# EAGLE design klavesnice (EAGLE 5.06)

## Sheet 1 of 3
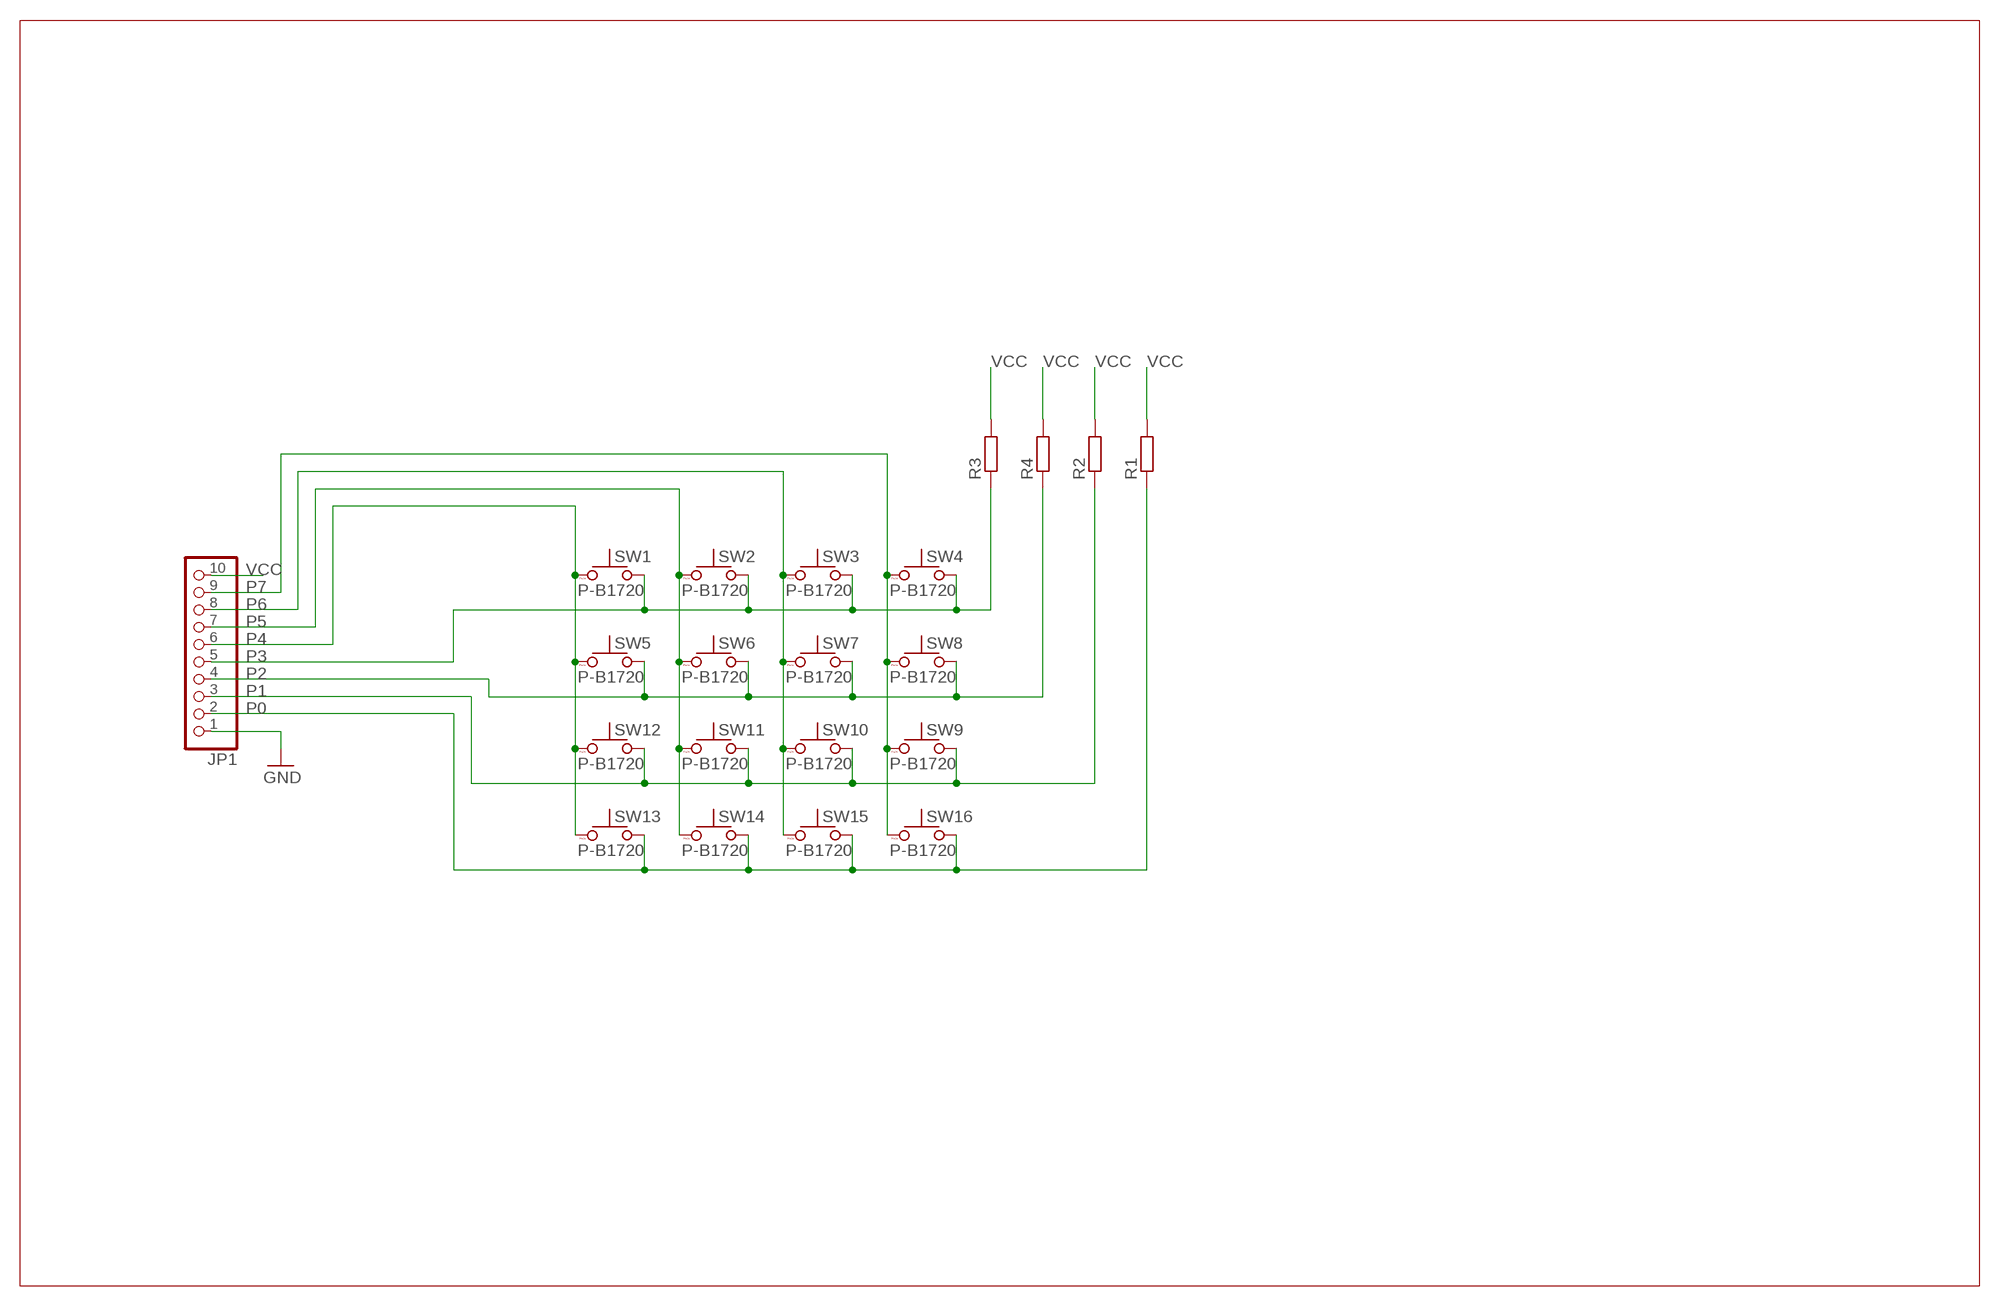
[diagram p0: schematic, sheet 1]

### Parts
JP1  PINHD-1X10_2.54-90°  [1X10/90]
R1  R-EU_M1206  [M1206]
R2  R-EU_M1206  [M1206]
R3  R-EU_M1206  [M1206]
R4  R-EU_M1206  [M1206]
SW1  P-B1720  [P-B1720]
SW2  P-B1720  [P-B1720]
SW3  P-B1720  [P-B1720]
SW4  P-B1720  [P-B1720]
SW5  P-B1720  [P-B1720]
SW6  P-B1720  [P-B1720]
SW7  P-B1720  [P-B1720]
SW8  P-B1720  [P-B1720]
SW9  P-B1720  [P-B1720]
SW10  P-B1720  [P-B1720]
SW11  P-B1720  [P-B1720]
SW12  P-B1720  [P-B1720]
SW13  P-B1720  [P-B1720]
SW14  P-B1720  [P-B1720]
SW15  P-B1720  [P-B1720]
SW16  P-B1720  [P-B1720]

### Nets
GND: JP1.1
P0: JP1.2 R1.1 SW13.2 SW14.2 SW15.2 SW16.2
P1: JP1.3 R2.1 SW9.2 SW10.2 SW11.2 SW12.2
P2: JP1.4 R4.1 SW5.2 SW6.2 SW7.2 SW8.2
P3: JP1.5 R3.1 SW1.2 SW2.2 SW3.2 SW4.2
P4: JP1.6 SW1.1 SW5.1 SW12.1 SW13.1
P5: JP1.7 SW2.1 SW6.1 SW11.1 SW14.1
P6: JP1.8 SW3.1 SW7.1 SW10.1 SW15.1
P7: JP1.9 SW4.1 SW8.1 SW9.1 SW16.1
VCC: JP1.10 R1.2 R2.2 R3.2 R4.2
Unconnected: SW1.3 SW1.4 SW2.3 SW2.4 SW3.3 SW3.4 SW4.3 SW4.4 SW5.3 SW5.4 SW6.3 SW6.4 SW7.3 SW7.4 SW8.3 SW8.4 SW9.3 SW9.4 SW10.3 SW10.4 SW11.3 SW11.4 SW12.3 SW12.4 SW13.3 SW13.4 SW14.3 SW14.4 SW15.3 SW15.4 SW16.3 SW16.4

## Sheet 2 of 3
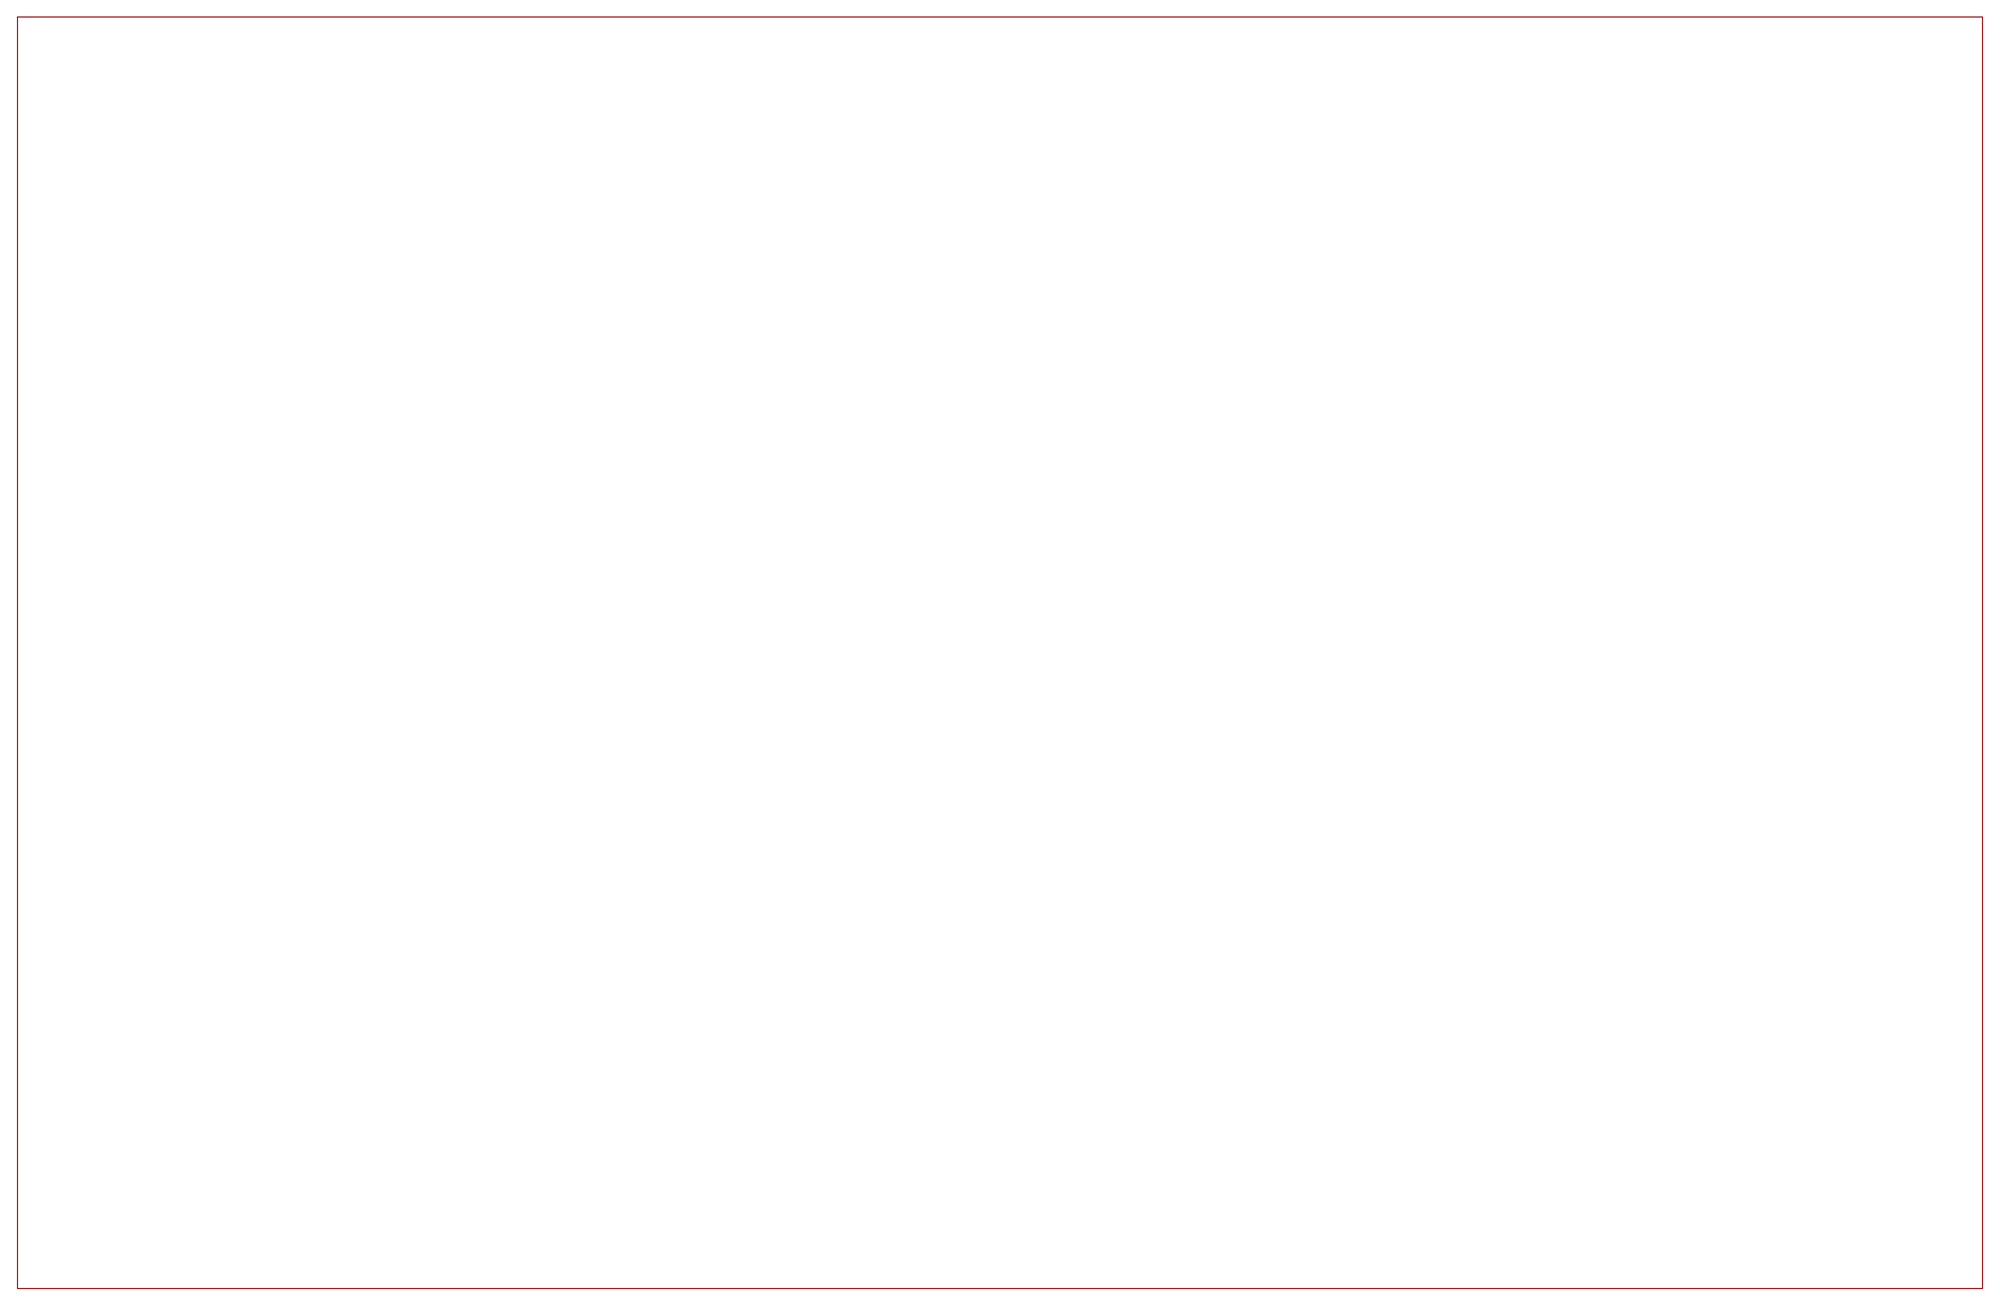
[diagram p1: schematic, sheet 2]

## Sheet 3 of 3
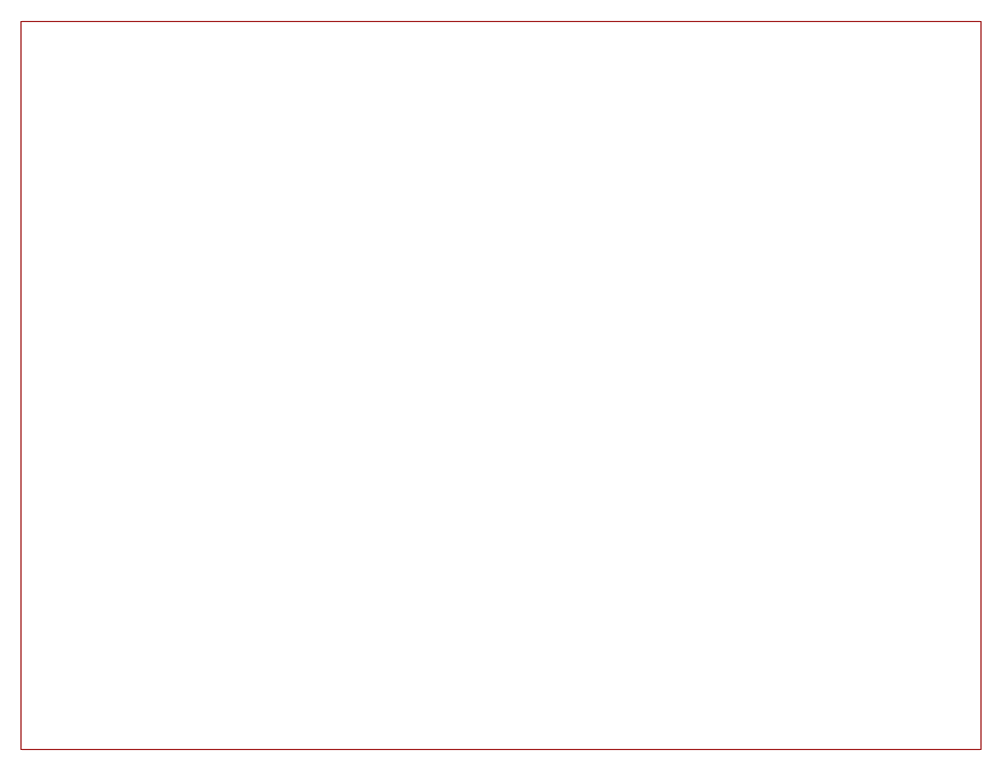
[diagram p2: schematic, sheet 3]

## Library data of the parts
JP1 = acon-tyco (19):PINHD-1X10: PIN HEADER
R1-R4 = resistor:R-EU_: RESISTOR, European symbol
SW1-SW16 = #PaJa_prepinace:P-B1720: µ-tlacitko

## Board
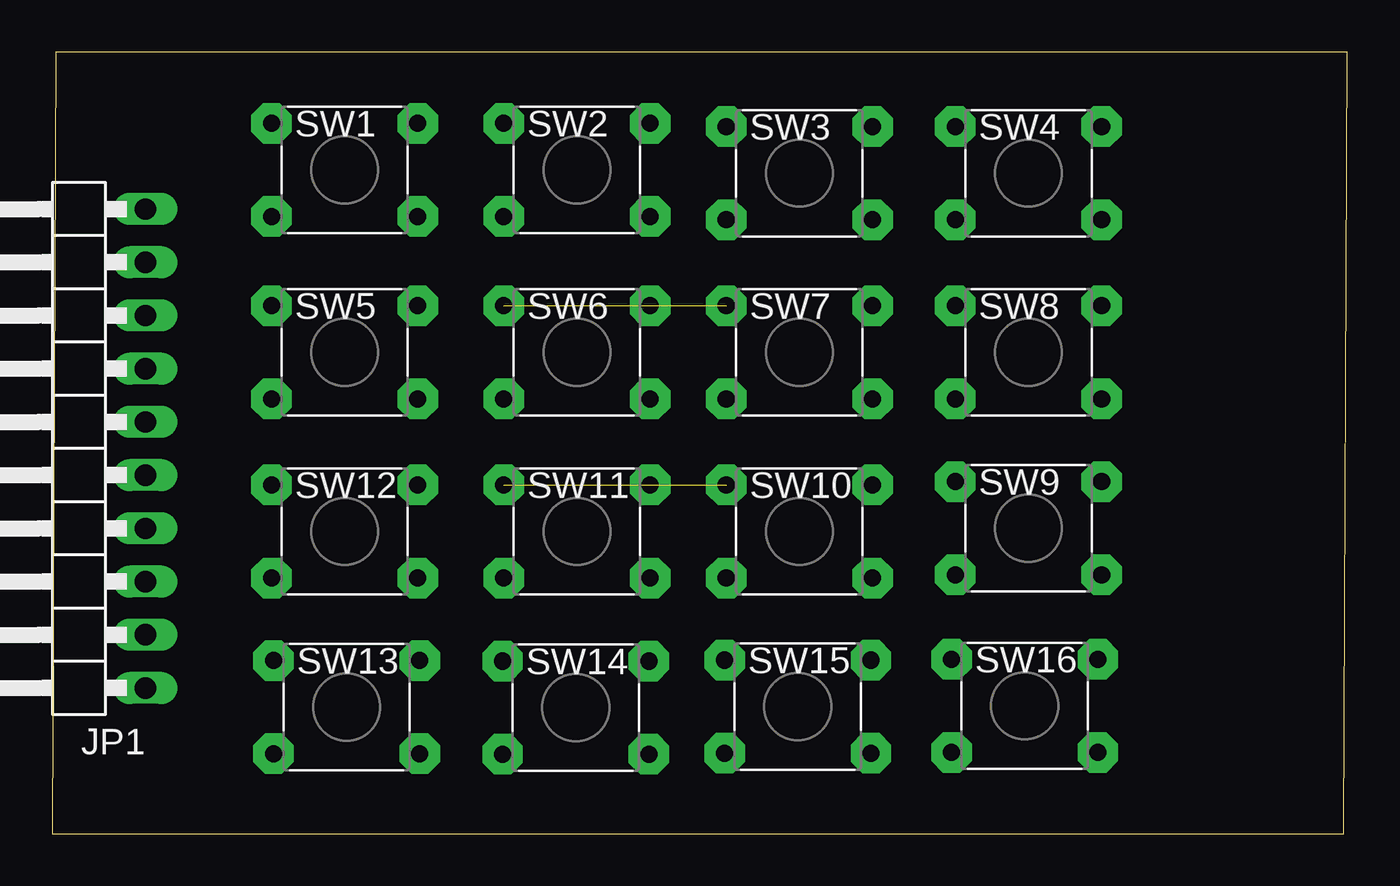
[diagram p3: board, top side]
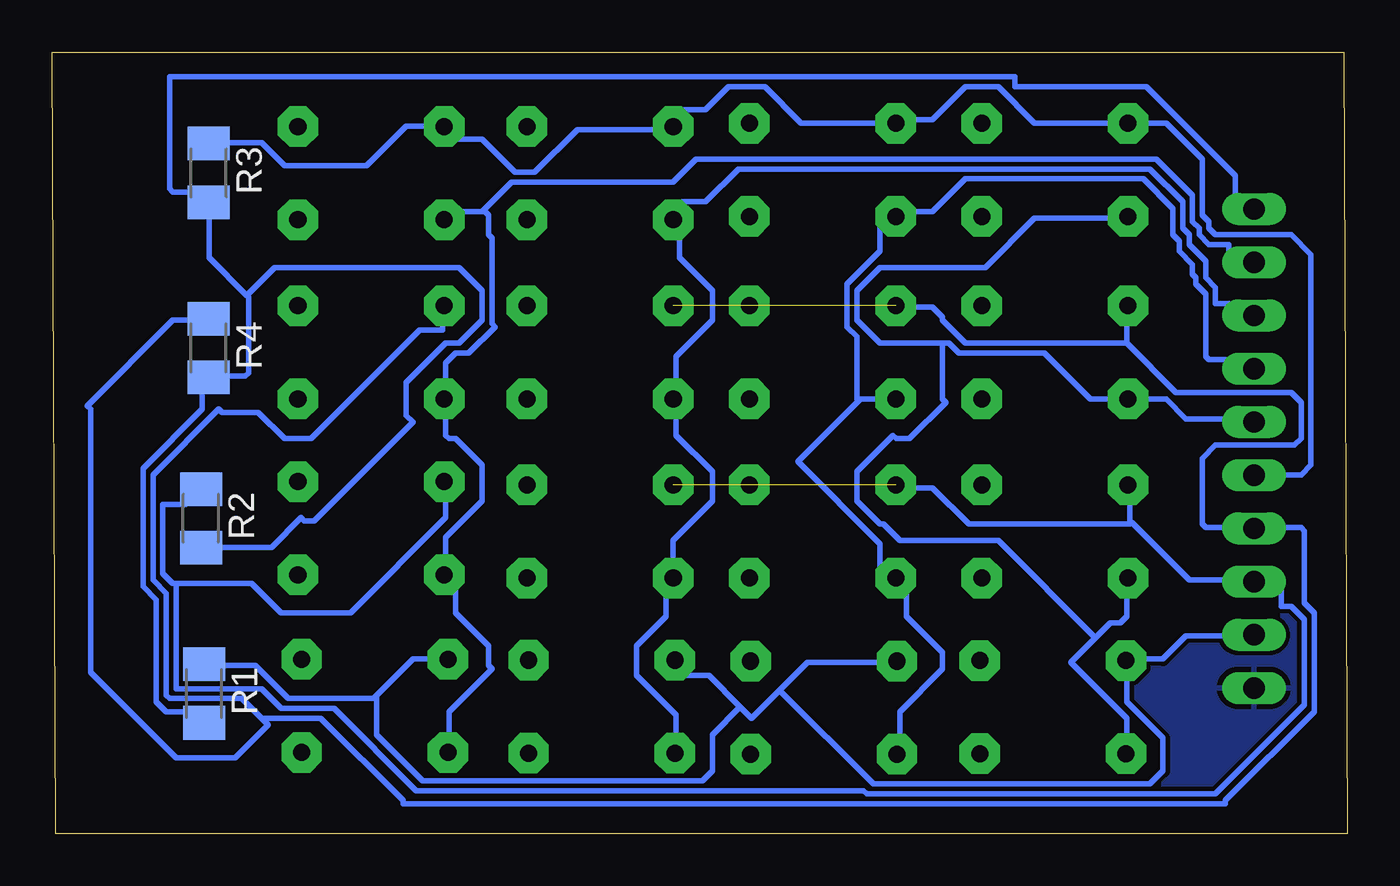
[diagram p4: board, bottom side, seen from below]

Size 61.8 x 37.29 mm. Coordinates in mm from the lower left corner, seen from the top.
Outline: 0,0 61.64,0 61.8,37.29 0.16,37.29 0,0
Copper layers (1*16): Top 0.035mm / dielectric 1.5mm / Bottom 0.035mm
Design rules "default": minimum track width 10mil, minimum drill 24mil, track to track 8mil, track to pad 8mil, pad to pad 8mil, via to via 8mil, smd to smd 8mil, copper to edge 40mil, drill to drill 8mil, minimum pad ring 10mil, minimum via ring 8mil, stop-mask expansion 4mil, vias tented up to drill 0mil, thermal gap 10mil

### Footprints (pad centres in the part's own frame; a part is rotated, then mirrored left to right if it is on the bottom)
1X10/90 = drill 1.016 long: 1 -11.43,-3.81; 2 -8.89,-3.81; 3 -6.35,-3.81; 4 -3.81,-3.81; 5 -1.27,-3.81; 6 1.27,-3.81; 7 3.81,-3.81; 8 6.35,-3.81; 9 8.89,-3.81; 10 11.43,-3.81
M1206 = smd 1.6 x 2: 1 -1.4,0; 2 1.4,0
P-B1720 = drill 0.813 pad 1.93 octagon: 1 -3.493,-2.223; 2 -3.493,2.223; 3 3.493,-2.223; 4 3.493,2.223

### Placement (x,y rotation side)
JP1  0.63,18.38 90 top
R1  54.55,6.69 270 bottom
R2  54.7,15.05 270 bottom
R3  54.34,31.54 270 bottom
R4  54.34,23.18 270 bottom
SW1  13.95,31.68 0 top
SW2  25.04,31.68 0 top
SW3  35.66,31.53 0 top
SW4  46.58,31.53 0 top
SW5  13.95,22.97 0 top
SW6  25.04,22.97 0 top
SW7  35.66,22.97 0 top
SW8  46.58,22.97 0 top
SW9  46.58,14.58 0 top
SW10  35.66,14.42 0 top
SW11  25.04,14.42 0 top
SW12  13.95,14.42 0 top
SW13  14.04,6.04 0 top
SW14  24.98,6.01 0 top
SW15  35.58,6.06 0 top
SW16  46.41,6.1 0 top

### Tracks (layer width: path | path; a pad name or v marks a point on that pad's centre or on a via)
GND
  pour Bottom: -2.04,39.11 64.37,39.11 64.37,-1.87 -2.04,-1.87 -2.04,38.95
P0
  Bottom 0.254: 46.39,6.53 44.59,8.33 43.02,8.33 SW16.2 | 46.39,6.53 46.47,6.45 50.55,6.45 52.12,8.02 54.48,8.02 R1.1 | JP1.2 4.55,9.43 7.69,9.43 8.79,8.33 10.52,8.33 SW13.2 10.52,8.18 10.52,6.29 8.79,4.56 8.79,3 9.42,2.37 22.61,2.37 27.08,6.84 | 27.08,6.84 28.42,5.51 28.97,6.06 | 27.08,6.84 25.75,8.18 21.51,8.18 SW14.2 | 28.97,6.06 30.46,7.55 31.56,7.55 32.19,8.18 SW15.2 | 46.39,6.53 46.31,6.45 46.31,4.72 44.12,2.52 30.77,2.52 30.3,3 30.3,4.72 28.97,6.06
P1  (1 unrouted)
  Bottom 0.254: 55.89,11.94 52.28,11.94 50.87,10.53 47.57,10.53 43.02,15.08 43.02,16.65 SW9.2 | 55.89,11.94 56.05,11.94 56.52,12.41 56.52,15.71 55.42,15.71 54.79,16.34 R2.1 | 10.28,14.85 10.36,14.93 10.36,16.5 SW12.2 | 10.28,14.85 7.54,12.1 4.55,12.1 JP1.3 4.4,11.94 4.24,11.79 3.3,11.79 3.14,11.63 3.14,10.84 2.67,10.84 2.04,10.22 2.04,6.13 6.28,1.9 22.92,1.9 23.08,2.05 44.43,2.05 48.36,5.98 50.87,5.98 51.81,6.92 55.89,6.92 55.89,11.94 | SW11.2 21.51,16.5 19.78,16.5 18.05,14.77 10.36,14.77 10.28,14.85
P2  (1 unrouted)
  Bottom 0.254: 10.52,23.41 8.16,21.05 2.67,21.05 2.2,20.58 2.2,18.85 2.51,18.54 6.28,18.54 6.91,17.91 6.91,14.77 6.75,14.61 4.55,14.61 JP1.4 4.4,14.61 2.2,14.61 2.04,14.46 2.04,11 1.57,10.53 1.57,5.82 5.81,1.58 5.81,1.42 45.06,1.42 45.06,1.58 48.98,5.51 51.65,5.51 51.73,5.43 | 10.52,23.41 10.52,25.13 SW5.2 | 10.52,23.41 18.21,23.41 19.31,24.5 19.31,24.66 19.78,25.13 21.51,25.13 SW6.2 | 51.73,5.43 52.75,6.45 56.21,6.45 56.36,6.61 56.36,11.47 56.99,12.1 56.99,17.12 53.85,20.27 53.69,20.11 51.97,20.11 50.71,18.85 49.45,18.85 44.27,24.03 43.17,24.03 43.17,25.13 SW8.2 | 51.73,5.43 51.5,5.19 53.07,3.62 55.89,3.62 59.97,7.71 59.97,20.27 60.13,20.42 56.05,24.5 54.48,24.5 R4.1
P3
  Bottom 0.254: JP1.5 4.4,17.12 2.2,17.12 1.73,17.6 1.73,27.64 2.67,28.59 6.28,28.59 6.59,28.9 6.59,29.21 6.91,29.53 6.91,32.2 8.63,33.92 10.36,33.92 SW1.2 10.52,33.92 14.91,33.92 16.64,35.65 18.21,35.65 19.78,34.08 21.35,34.08 21.51,33.92 SW2.2 21.67,33.92 26.06,33.92 27.79,35.65 29.52,35.65 30.61,34.55 31.71,34.55 32.34,33.92 32.19,33.77 SW3.2 32.19,33.61 36.74,33.61 38.78,31.57 39.72,31.57 41.29,33.14 42.55,33.14 43.02,33.61 SW4.2 43.17,33.77 44.9,33.77 46.79,31.88 50.71,31.88 51.81,32.98 54.32,32.98 R3.1
P4
  Bottom 0.254: 12.01,9.35 13.19,8.18 10.52,5.51 10.52,3.94 SW13.1 | 12.01,9.35 11.3,10.06 10.83,10.06 10.52,10.37 10.52,12.1 SW12.1 | JP1.6 4.55,19.79 7.69,19.79 8.63,20.74 10.36,20.74 SW5.1 10.52,20.74 12.25,20.74 14.44,22.93 18.53,22.93 19,23.41 19.31,23.41 | 19.31,23.41 22.29,23.41 23.39,24.5 23.39,25.92 22.29,27.02 17.27,27.02 14.91,29.37 10.52,29.37 SW1.1 | 19.31,23.41 19.31,20.74 19.15,20.58 20.88,18.85 21.51,18.85 21.67,19.01 23.39,17.28 23.39,15.87 22.29,14.77 22.14,14.77 21.35,13.98 16.64,13.98 12.01,9.35
P5
  Bottom 0.254: SW14.1 21.35,3.94 21.35,5.82 19.31,7.86 19.31,8.65 21.04,10.37 21.04,11.63 21.51,12.1 SW11.1 21.67,12.1 22.29,12.73 22.29,13.83 26.22,17.75 23.31,20.66 | 23.31,20.66 23.24,20.74 21.67,20.74 SW6.1 | JP1.7 4.55,22.31 5.5,22.31 5.81,22.62 6.59,22.62 6.75,22.78 6.75,25.76 7.22,26.23 7.22,26.55 7.38,26.7 7.38,27.17 8.01,27.8 8.01,28.27 8.32,28.59 8.32,29.84 9.73,31.26 18.21,31.26 19.78,29.69 21.35,29.69 21.51,29.53 SW2.1 21.67,29.53 22.29,28.9 22.29,27.8 23.86,26.23 23.86,24.19 23.39,23.72 23.39,20.74 23.31,20.66
P6
  Bottom 0.254: SW15.1 32.03,3.94 32.03,5.66 33.91,7.55 33.91,8.96 32.5,10.37 32.5,11.79 32.19,12.1 SW10.1 32.19,12.26 32.19,13.98 30.3,15.87 30.3,17.28 32.03,19.01 32.03,20.74 SW7.1 32.03,20.89 32.03,22.78 30.3,24.5 30.3,25.92 31.87,27.49 31.87,29.06 32.03,29.21 SW3.1 32.19,29.37 32.34,29.53 31.71,30.16 30.61,30.16 29.05,31.73 9.42,31.73 7.85,30.16 7.85,28.9 7.54,28.59 7.54,28.12 6.75,27.33 6.75,26.55 6.28,26.07 6.28,25.29 5.65,25.29 5.18,24.82 4.55,24.82 JP1.8
P7
  Bottom 0.254: SW16.1 42.86,3.94 42.86,5.82 40.82,7.86 40.98,8.02 40.98,8.96 42.55,10.53 42.55,11.79 43.02,12.26 SW9.1 43.02,12.41 43.02,14.14 41.29,15.87 41.29,17.6 42.55,18.85 42.86,18.85 43.02,19.01 43.02,20.74 SW8.1 43.02,20.89 43.02,22.46 42.55,22.93 41.92,22.93 40.66,24.19 40.82,24.35 40.82,28.43 40.98,28.59 40.98,29.53 41.21,29.76 | 41.21,29.76 41.29,29.69 42.7,29.69 43.02,29.37 SW4.1 | 41.21,29.76 39.88,31.1 32.19,31.1 31.09,32.2 9.11,32.2 7.38,30.47 7.38,29.21 7.07,28.9 7.07,28.59 6.59,28.12 5.65,28.12 5.65,27.8 5.18,27.33 4.55,27.33 JP1.9
VCC
  Bottom 0.254: 52.52,25.68 52.44,25.6 52.44,21.99 52.59,21.84 54.32,21.84 R4.2 54.48,21.68 54.64,21.52 54.64,20.27 57.46,17.44 57.46,11.79 56.83,11.16 56.83,6.29 56.36,5.82 55.42,5.82 54.95,5.35 54.64,5.35 R1.2 | 52.52,25.68 54.32,27.49 54.32,30 R3.2 54.48,30.16 54.95,30.63 56.05,30.63 56.21,30.78 56.21,36.12 15.86,36.12 15.86,35.65 9.58,35.65 5.34,31.41 5.34,30.47 4.71,29.84 4.55,29.84 JP1.10 | R2.2 54.64,13.67 51.34,13.67 49.93,15.08 49.77,14.93 49.3,14.93 44.59,19.64 44.9,19.95 44.9,21.52 43.02,23.41 42.39,23.41 41.29,24.5 41.29,25.92 42.39,27.02 51.18,27.02 52.52,25.68